# Altium schematic sheet Voltage_Measurement.SchDoc
size A4; SheetNumber: 3; SheetTotal: 5
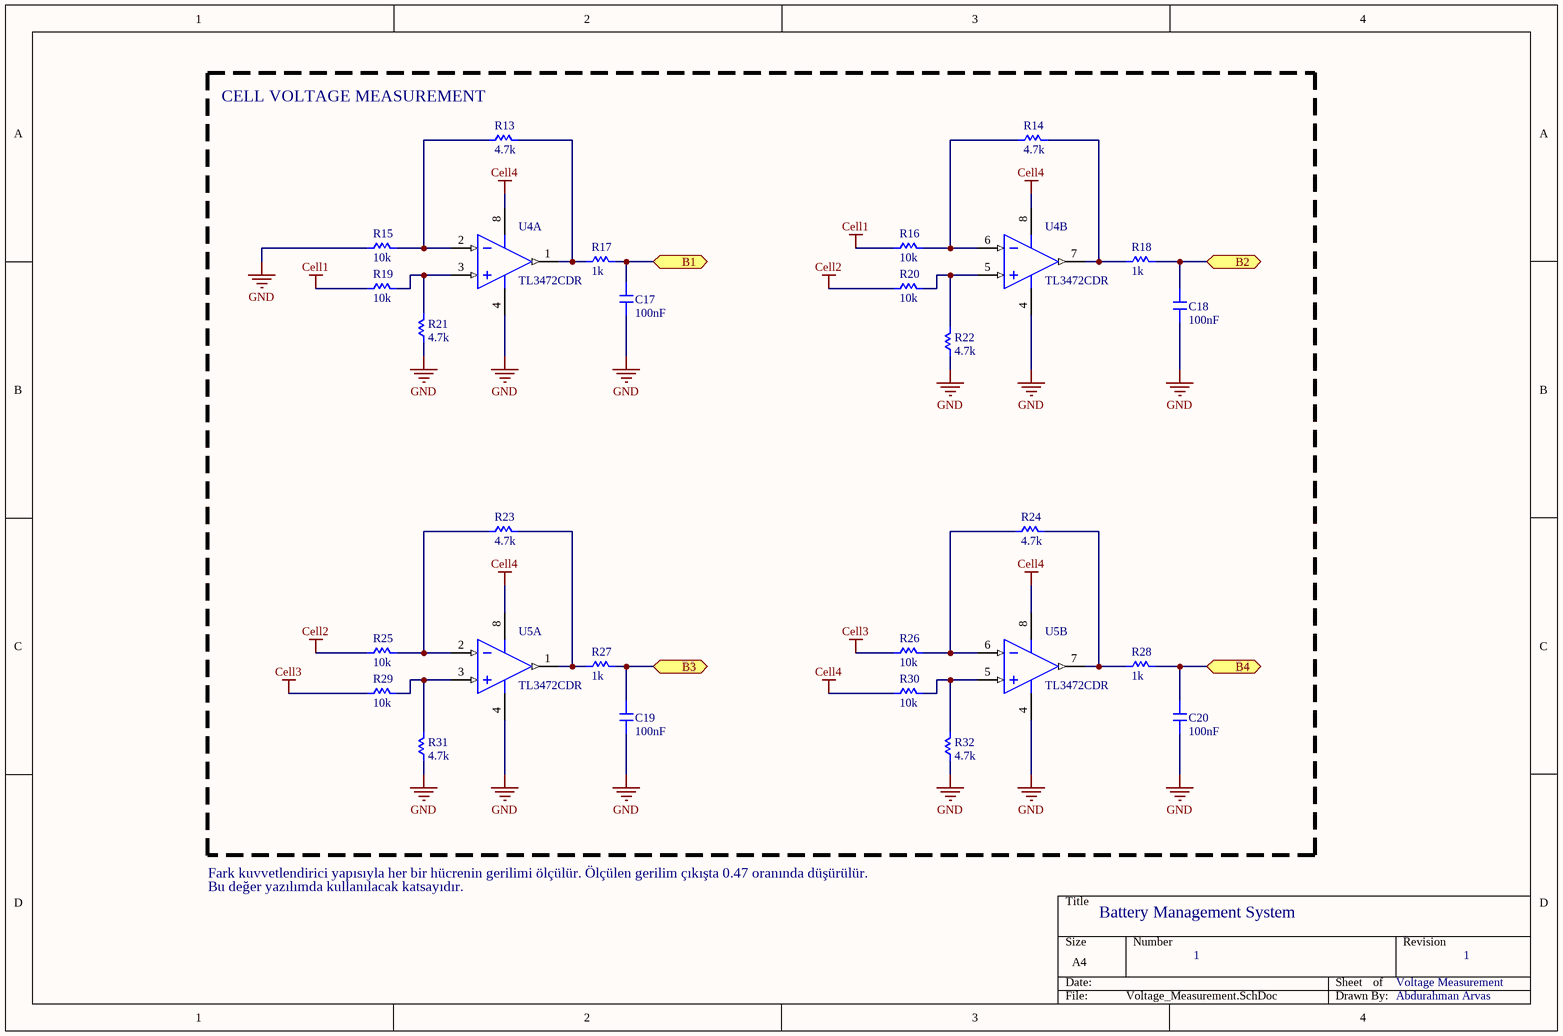
[diagram p0: Voltage_Measurement.SchDoc]

## Parts
C17  100nF  [C0805]
C18  100nF  [C0805]
C19  100nF  [C0805]
C20  100nF  [C0805]
R13  4.7k  [R0805]
R14  4.7k  [R0805]
R15  10k  [R0805]
R16  10k  [R0805]
R17  1k  [R0805]
R18  1k  [R0805]
R19  10k  [R0805]
R20  10k  [R0805]
R21  4.7k  [R0805]
R22  4.7k  [R0805]
R23  4.7k  [R0805]
R24  4.7k  [R0805]
R25  10k  [R0805]
R26  10k  [R0805]
R27  1k  [R0805]
R28  1k  [R0805]
R29  10k  [R0805]
R30  10k  [R0805]
R31  4.7k  [R0805]
R32  4.7k  [R0805]
U4  TL3472CDR  [D0008A_L]  (parts A,B of 2)
U5  TL3472CDR  [D0008A_L]  (parts A,B of 2)

## Blocks framed on the sheet
CELL VOLTAGE MEASUREMENT: C17-C20 R13-R32 U4 U5

## Ports
B1 (bidir), B2 (bidir), B3 (bidir), B4 (bidir)

## Nets
Cell1: R16.1 R19.1
Cell2: R20.1 R25.1
Cell3: R26.1 R29.1
Cell4: R30.1 U4.8(VCC+) U5.8(VCC+)
GND: C17.1 C18.1 C19.1 C20.1 R15.1 R21.1 R22.1 R31.1 R32.1 U4.4(VCC-/GND) U5.4(VCC-/GND)
B1: C17.2 R17.2 ; port B1
B2: C18.2 R18.2 ; port B2
B3: C19.2 R27.2 ; port B3
B4: C20.2 R28.2 ; port B4
NetR13_1: R13.1 R15.2 U4.2(IN1-)
NetR13_2: R13.2 R17.1 U4.1(OUT1)
NetR14_1: R14.1 R16.2 U4.6(IN2-)
NetR14_2: R14.2 R18.1 U4.7(OUT2)
NetR19_2: R19.2 R21.2 U4.3(IN1+)
NetR20_2: R20.2 R22.2 U4.5(IN2+)
NetR23_1: R23.1 R25.2 U5.2(IN1-)
NetR23_2: R23.2 R27.1 U5.1(OUT1)
NetR24_1: R24.1 R26.2 U5.6(IN2-)
NetR24_2: R24.2 R28.1 U5.7(OUT2)
NetR29_2: R29.2 R31.2 U5.3(IN1+)
NetR30_2: R30.2 R32.2 U5.5(IN2+)

## Notes on the sheet
- Fark kuvvetlendirici yapısıyla her bir hücrenin gerilimi ölçülür. Ölçülen gerilim çıkışta 0.47 oranında düşürülür.
- Bu değer yazılımda kullanılacak katsayıdır.
- Battery Management System
- 1
- Voltage Measurement
- Abdurahman Arvas

## Library data of the parts
C17-C20 = SMD_Capacitor
R13-R32 = SMD Resistor: SMD Chip Resistor
U4 U5 = CMP-0015-00034-2: High-Slew-Rate, Single-Supply Operational Amplifier, 4 to 36 V, 0 to 70 degC, 8-pin SOIC (D8), Green (RoHS & no Sb/Br); Manufacturer: Texas Instruments; Total Supply Voltage(Max)(+5V is 5, +/-5V is 10): 36; Number of Channels: 2; Slew Rate(Typ)(V/us): 13; IIB(Max)(pA): 500000; CMRR(Min)(dB): 65; Total Supply Voltage(Min)(+5V is 5, +/-5V is 10): 4; Rating: Catalog; Sub Family: General Purpose Amplifier, High Supply Voltage Amplifier (>=30V); Vn at 1kHz(Typ)(nV/rtHz): 49; Offset Drift(Typ)(uV/C): 10; Iq per channel(Max)(mA): 4.5; ComponentLink3URL: http://www.ti.com/litv/pdf/msoi002j; PackageDescription: 8-Pin Plastic Small Outline, Body 4.9 x 3.9 mm, Pitch 1.27 mm; DatasheetVersion: SLOS200G; ComponentLink3Description: Package Specification; PartNumber: TL3472CDR; ComponentLink2Description: Datasheet; Code_JEDEC: MS-012; Mounting Technology: Surface Mount; PackageReference: D0008A; GBW(Typ)(MHz): 4; PackageVersion: 4040047-3/M, 06/2011; ComponentLink2URL: http://www.ti.com/lit/ds/symlink/tl3472.pdf; ComponentLink1URL: http://www.ti.com/; Vio (25C)(Max)(mV): 10; Eco-Plan: Green (RoHS & no Sb/Br); ComponentLink1Description: Manufacturer URL